# Altium schematic sheet CELL_BALANCE.SchDoc
size A4
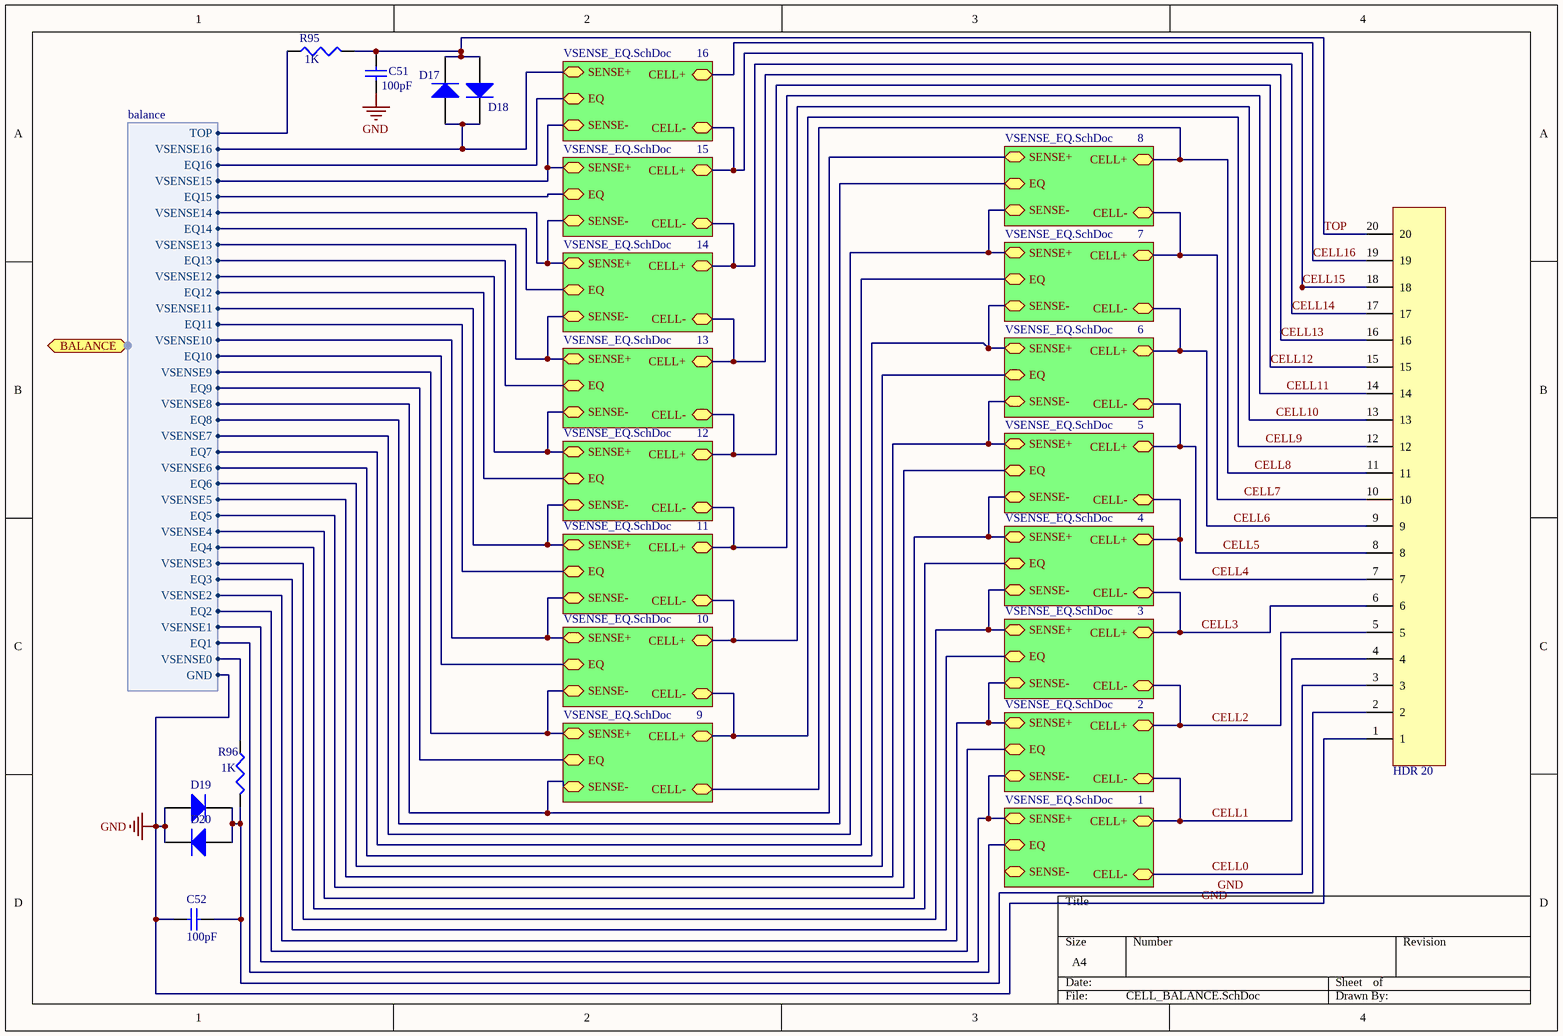
[diagram p0: CELL_BALANCE.SchDoc]

## Parts
?  HDR 20
C51  value 100pF  [C1206]  (hidden comment: Cap Semi)
C52  value 100pF  [C1206]  (hidden comment: Cap Semi)
D17  (no value)  [SMC]
D18  (no value)  [SMC]
D19  (no value)  [SMC]
D20  (no value)  [SMC]
R95  value 1K  [J1-0603]  (hidden comment: Res3)
R96  value 1K  [J1-0603]  (hidden comment: Res3)

## Sub-sheets
1 = VSENSE_EQ.SchDoc: SENSE+, CELL+, SENSE-, CELL-, EQ
2 = VSENSE_EQ.SchDoc: SENSE+, CELL+, SENSE-, CELL-, EQ
3 = VSENSE_EQ.SchDoc: SENSE+, CELL+, SENSE-, CELL-, EQ
4 = VSENSE_EQ.SchDoc: SENSE+, CELL+, SENSE-, CELL-, EQ
5 = VSENSE_EQ.SchDoc: SENSE+, CELL+, SENSE-, CELL-, EQ
6 = VSENSE_EQ.SchDoc: SENSE+, CELL+, SENSE-, CELL-, EQ
7 = VSENSE_EQ.SchDoc: SENSE+, CELL+, SENSE-, CELL-, EQ
8 = VSENSE_EQ.SchDoc: SENSE+, CELL+, SENSE-, CELL-, EQ
9 = VSENSE_EQ.SchDoc: SENSE+, CELL+, SENSE-, CELL-, EQ
10 = VSENSE_EQ.SchDoc: SENSE+, CELL+, SENSE-, CELL-, EQ
11 = VSENSE_EQ.SchDoc: SENSE+, CELL+, SENSE-, CELL-, EQ
12 = VSENSE_EQ.SchDoc: SENSE+, CELL+, SENSE-, CELL-, EQ
13 = VSENSE_EQ.SchDoc: SENSE+, CELL+, SENSE-, CELL-, EQ
14 = VSENSE_EQ.SchDoc: SENSE+, CELL+, SENSE-, CELL-, EQ
15 = VSENSE_EQ.SchDoc: SENSE+, CELL+, SENSE-, CELL-, EQ
16 = VSENSE_EQ.SchDoc: SENSE+, CELL+, SENSE-, CELL-, EQ

## Ports
BALANCE (harness balance)

## Harnesses
balance: GND, VSENSE0, EQ1, VSENSE1, EQ2, VSENSE2, EQ3, VSENSE3, EQ4, VSENSE4, EQ5, VSENSE5, EQ6, VSENSE6, EQ7, VSENSE7, EQ8, VSENSE8, EQ9, VSENSE9, EQ10, VSENSE10, EQ11, VSENSE11, EQ12, VSENSE12, EQ13, VSENSE13, EQ14, VSENSE14, EQ15, VSENSE15, EQ16, VSENSE16, TOP

## Nets
GND: ?.1 ?.2 C51.1 C52.1 C52.2 D19.1(A) D19.2(K) D20.1(A) D20.2(K) R96.2 ; port BALANCE.GND
CELL0: ?.3 ; sheet 1/CELL-
CELL1: ?.4 ; sheet 2/CELL-, sheet 1/CELL+
CELL2: ?.5 ; sheet 3/CELL-, sheet 2/CELL+
CELL3: ?.6 ; sheet 4/CELL-, sheet 3/CELL+
CELL4: ?.7 ; sheet 4/CELL+, sheet 5/CELL-
CELL5: ?.8 ; sheet 5/CELL+, sheet 6/CELL-
CELL6: ?.9 ; sheet 6/CELL+, sheet 7/CELL-
CELL7: ?.10 ; sheet 7/CELL+, sheet 8/CELL-
CELL8: ?.11 ; sheet 8/CELL+, sheet 9/CELL-
CELL9: ?.12 ; sheet 10/CELL-, sheet 9/CELL+
CELL10: ?.13 ; sheet 11/CELL-, sheet 10/CELL+
CELL11: ?.14 ; sheet 12/CELL-, sheet 11/CELL+
CELL12: ?.15 ; sheet 12/CELL+, sheet 13/CELL-
CELL13: ?.16 ; sheet 13/CELL+, sheet 14/CELL-
CELL14: ?.17 ; sheet 14/CELL+, sheet 15/CELL-
CELL15: ?.18 ; sheet 15/CELL+, sheet 16/CELL-
CELL16: ?.19 ; sheet 16/CELL+
TOP: ?.20 C51.2 D17.2(K) D18.1(A) R95.2
NetD17_1: D17.1(A) D18.2(K) ; sheet 16/SENSE+, port BALANCE.VSENSE16
NetR95_1: R95.1 ; port BALANCE.TOP
NetR96_1: R96.1 ; port BALANCE.VSENSE0
(unnamed): sheet 4/SENSE+, sheet 5/SENSE-, port BALANCE.VSENSE4
(unnamed): sheet 4/SENSE-, sheet 3/SENSE+, port BALANCE.VSENSE3
(unnamed): sheet 4/EQ, port BALANCE.EQ4
(unnamed): sheet 3/SENSE-, sheet 2/SENSE+, port BALANCE.VSENSE2
(unnamed): sheet 3/EQ, port BALANCE.EQ3
(unnamed): sheet 2/SENSE-, sheet 1/SENSE+, port BALANCE.VSENSE1
(unnamed): sheet 2/EQ, port BALANCE.EQ2
(unnamed): sheet 1/EQ, port BALANCE.EQ1
(unnamed): sheet 5/SENSE+, sheet 6/SENSE-, port BALANCE.VSENSE5
(unnamed): sheet 5/EQ, port BALANCE.EQ5
(unnamed): sheet 6/SENSE+, sheet 7/SENSE-, port BALANCE.VSENSE6
(unnamed): sheet 6/EQ, port BALANCE.EQ6
(unnamed): sheet 7/SENSE+, sheet 8/SENSE-, port BALANCE.VSENSE7
(unnamed): sheet 7/EQ, port BALANCE.EQ7
(unnamed): sheet 8/SENSE+, sheet 9/SENSE-, port BALANCE.VSENSE8
(unnamed): sheet 8/EQ, port BALANCE.EQ8
(unnamed): sheet 12/SENSE+, sheet 13/SENSE-, port BALANCE.VSENSE12
(unnamed): sheet 12/SENSE-, sheet 11/SENSE+, port BALANCE.VSENSE11
(unnamed): sheet 12/EQ, port BALANCE.EQ12
(unnamed): sheet 11/SENSE-, sheet 10/SENSE+, port BALANCE.VSENSE10
(unnamed): sheet 11/EQ, port BALANCE.EQ11
(unnamed): sheet 10/SENSE-, sheet 9/SENSE+, port BALANCE.VSENSE9
(unnamed): sheet 10/EQ, port BALANCE.EQ10
(unnamed): sheet 9/EQ, port BALANCE.EQ9
(unnamed): sheet 13/SENSE+, sheet 14/SENSE-, port BALANCE.VSENSE13
(unnamed): sheet 13/EQ, port BALANCE.EQ13
(unnamed): sheet 14/SENSE+, sheet 15/SENSE-, port BALANCE.VSENSE14
(unnamed): sheet 14/EQ, port BALANCE.EQ14
(unnamed): sheet 15/SENSE+, sheet 16/SENSE-, port BALANCE.VSENSE15
(unnamed): sheet 15/EQ, port BALANCE.EQ15
(unnamed): sheet 16/EQ, port BALANCE.EQ16

## Library data of the parts
? = HDR 20: Manufacturer: Molex; Manufacturer Part Number: 70555-0054; Current Rating: 3A; Voltage Rating: 250V; Number of Positions: 20; Pitch: 2.54mm; Mating Post Length: 6.1mm; Glow Wire Compliant: Non-compliant; Supplier 1: Digi-Key; Supplier Part Number 1: 0705550054-ND; Stock 1: 0; Pricing 1: 360=6.1646 (USD); Contact Plating: Gold; Contact Material: Bronze,Copper; Material: Brass; Colour: Black; Housing Material: Polyester; Number of Rows: 1; Packaging: Rail/Tube; Contact Gender: Male; Termination: Through Hole; Number of Contacts: 20; Orientation: Right Angle; Voltage Rating (DC): 250V; Number of Circuits: 20; Termination Post Length: 3.3mm; ELV: Compliant; Flammability Rating: UL94 V-0
C51 C52 = Cap Semi: Capacitor (Semiconductor SIM Model); Published: 8-Jun-2000; LatestRevisionDate: 29-May-2009; LatestRevisionNote: IPC-7351 Footprint Added.; PackageReference: C1206; Publisher: Altium Limited; PackageDescription: Chip Capacitor
D17-D20 = Diode: Default Diode; Published: 8-Jun-2000; LatestRevisionDate: 17-Jul-2002; LatestRevisionNote: Re-released for DXP Platform.; PackageVersion: Sep-1996; PackageReference: SMC; Publisher: Altium Limited; PackageDescription: DO-214-AB/SMC; 2 C-Bend Leads; Body 7.9 x 5.9 mm, inc. leads (LxW); Code_JEDEC: DO-214-AB
R95 R96 = Res3: Resistor; Published: 8-Jun-2000; LatestRevisionDate: 29-May-2009; LatestRevisionNote: IPC-7351 Footprint Added.; PackageReference: J1-0603; Publisher: Altium Limited; PackageDescription: Chip Resistor